# EAGLE design W682X (EAGLE 6.6.0)
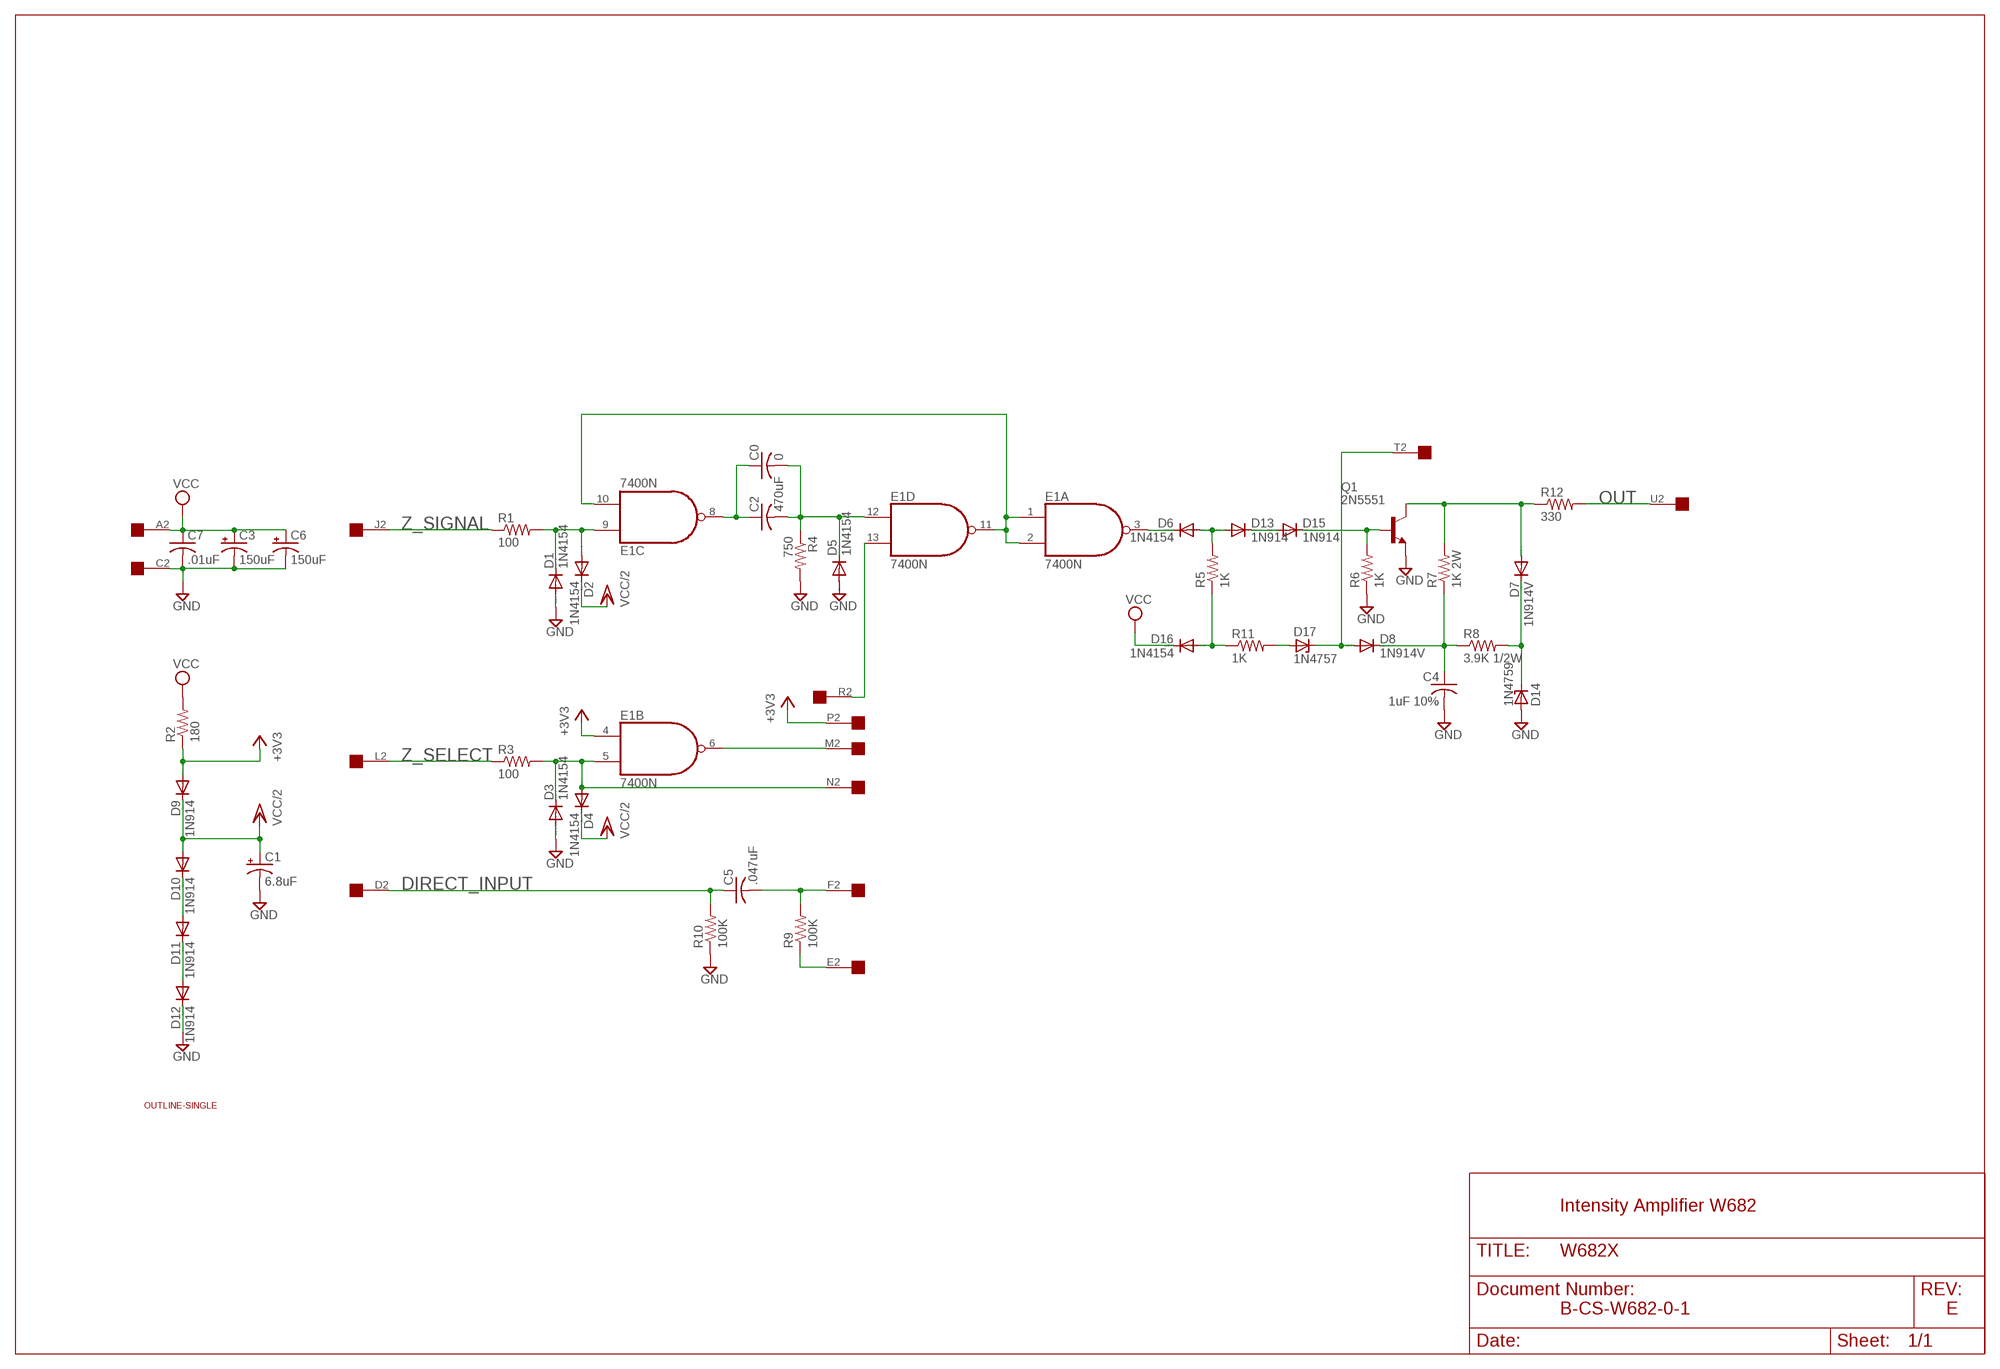
[diagram p0: schematic, sheet 1]

## Parts
C0  0  C-US050-025X075  [C050-025X075]
C1  6.8uF  CPOL-USE20-8AXIAL  [E12-8]
C2  470uF  C-US050-025X075  [C050-025X075]
C3  150uF  CPOL-USE22-9AXIAL  [E22-9]
C4  1uF 10%  C-US325-137X374  [C325-137X374]
C5  .047uF  C-US275-093X316  [C275-093X316]
C6  150uF  CPOL-USE22-9AXIAL  [E22-9]
C7  .01uF  C-US050-025X075  [C050-025X075]
D1  1N4154  DIODE-DO35-10  [DO35-10]
D2  1N4154  DIODE-DO35-10  [DO35-10]
D3  1N4154  DIODE-DO35-10  [DO35-10]
D4  1N4154  DIODE-DO35-10  [DO35-10]
D5  1N4154  DIODE-DO35-10  [DO35-10]
D6  1N4154  DIODE-DO35-10  [DO35-10]
D7  1N914V  DIODE-DO41-10  [DO41-10]
D8  1N914V  DIODE-DO41-10  [DO41-10]
D9  1N914  DIODE-DO35-10  [DO35-10]
D10  1N914  DIODE-DO35-10  [DO35-10]
D11  1N914  DIODE-DO35-10  [DO35-10]
D12  1N914  DIODE-DO35-10  [DO35-10]
D13  1N914  DIODE-DO35-10  [DO35-10]
D14  1N4759  ZENER-DIODEZD-12.5  [ZDIO12.5]
D15  1N914  DIODE-DO35-10  [DO35-10]
D16  1N4154  DIODE-DO35-10  [DO35-10]
D17  1N4757  ZENER-DIODEZD-12.5  [ZDIO12.5]
E1  7400N  [DIL14]
Q1  2N5551  2N2102-NPN-TO39-EBC  [TO39]
R1  100  R-US_0207/10  [0207/10]
R2  180  R-US_0207/10  [0207/10]
R3  100  R-US_0207/10  [0207/10]
R4  750  R-US_0207/10  [0207/10]
R5  1K  R-US_0207/10  [0207/10]
R6  1K  R-US_0207/10  [0207/10]
R7  1K 2W  R-US_0818/25  [0818/25]
R8  3.9K 1/2W  R-US_0411/15  [0411/15]
R9  100K  R-US_0207/10  [0207/10]
R10  100K  R-US_0207/10  [0207/10]
R11  1K  R-US_0207/10  [0207/10]
R12  330  R-US_0207/10  [0207/10]
U$1  OUTLINE-SINGLE  [SINGLE]
U$2  EDGE-1  [EDGE-CON1]

## Nets
+3V3 [supply]: D9.A E1.4(B:I0) R2.1 U$2.P2
DIRECT_INPUT: C5.1 R10.2 U$2.D2
GND [supply]: C1.- C3.- C4.2 C6.- C7.2 D1.A D3.A D5.A D12.C D14.A Q1.1(E) R4.2 R6.1 R10.1 U$2.C2
N$1: E1.13(D:I1) U$2.R2
N$2: D1.C D2.A E1.9(C:I0) R1.2
N$3: E1.1(A:I0) E1.2(A:I1) E1.10(C:I1) E1.11(D:O)
N$4: C0.2 C2.2 D5.C E1.12(D:I0) R4.1
N$5: C0.1 C2.1 E1.8(C:O)
N$6: D3.C D4.A E1.5(B:I1) R3.2 U$2.N2
N$7: D11.C D12.A
N$8: D10.C D11.A
N$9: E1.6(B:O) U$2.M2
N$10: C5.2 R9.2 U$2.F2
N$11: R9.1 U$2.E2
N$13: D16.A R5.1 R11.1
N$14: C4.1 D8.C R7.1 R8.1
N$15: D7.A Q1.3(C) R7.2 R12.1
N$16: D7.C D14.C R8.2
N$17: D6.C E1.3(A:O)
N$18: D6.A D13.A R5.2
N$19: D17.A R11.2
N$20: D8.A D17.C U$2.T2
N$21: D15.C Q1.2(B) R6.2
N$22: D13.C D15.A
OUT: R12.2 U$2.U2
VCC [supply]: C3.+ C6.+ C7.1 D16.C R2.2 U$2.A2
VCC/2 [supply]: C1.+ D2.C D4.C D9.C D10.A
Z_SELECT: R3.1 U$2.L2
Z_SIGNAL: R1.1 U$2.J2
Unconnected: U$2.B2 U$2.H2 U$2.K2 U$2.S2 U$2.V2

## Notes on the sheet
- Intensity Amplifier W682
- B-CS-W682-0-1 | E

## Power pins joined to a net without a drawn wire
GND: E1.7(P:GND)
VCC: E1.14(P:VCC)

## Library data of the parts
C0 C2 C4 C5 C7 = rcl:C-US: CAPACITOR, American symbol
C1 = dec-con:CPOL-USE20-8AXIAL: A 0.8 inch electrolytic.
C3 C6 = rcl:CPOL-US: POLARIZED CAPACITOR, American symbol
D1-D13 D15 D16 = diode:DIODE-: DIODE
D14 D17 = diode:ZENER-DIODE: Z-Diode
E1 = 74xx-us:74*00: Quad 2-input NAND gate
Q1 = transistor:*-NPN-: NPN Transistror BF959 corrected 2008.03.06
R1-R6 R8-R12 = rcl:R-US_: RESISTOR, American symbol
R7 = dec-con:R-US_0818/25: One inch resistor
U$1 = dec-con:OUTLINE-*: Board outlines for DEC boards.
U$2 = dec-con:EDGE-1: Single-Sided DEC Edge Connector -- (side 2)

## Net classes
1 supply: width 0.813 mm

## Board
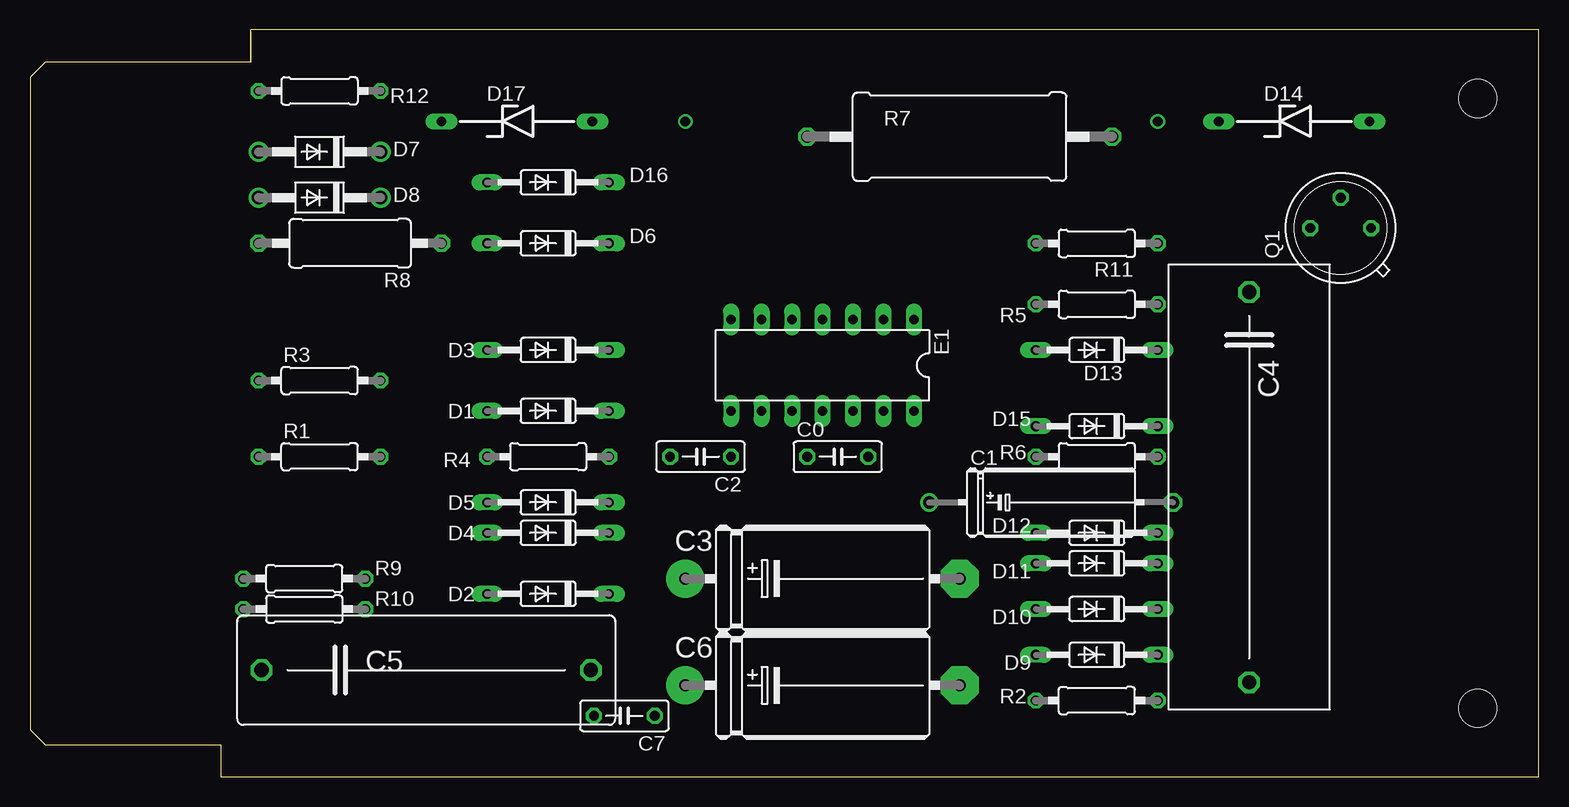
[diagram p1: board, top side]
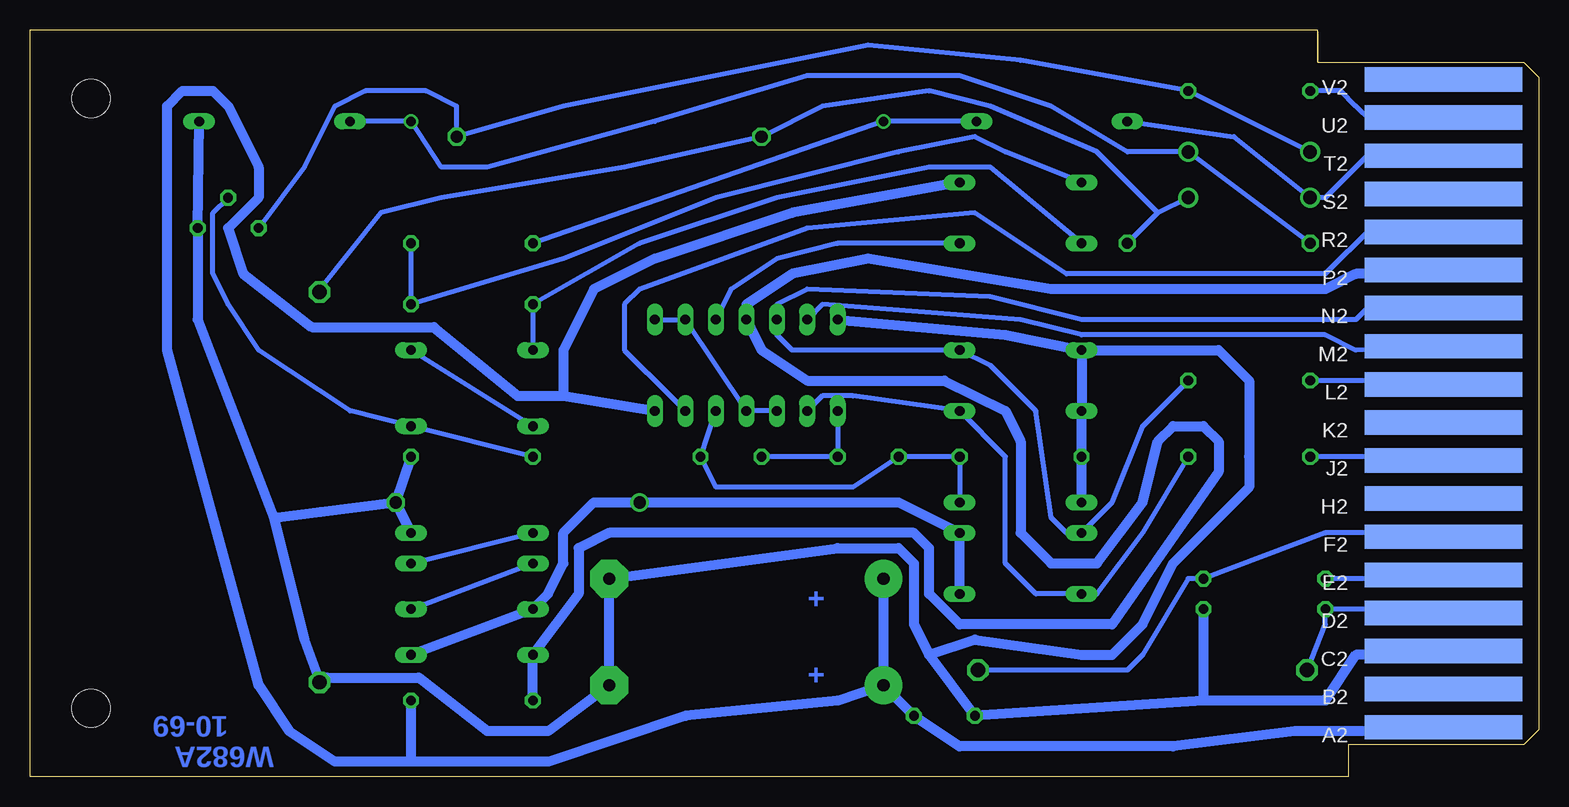
[diagram p2: board, bottom side, seen from below]

Size 125.73 x 62.23 mm. Coordinates in mm from the lower left corner, seen from the top.
Copper layers (1+16): Top 0.035mm / dielectric 1.5mm / Bottom 0.035mm
Design rules "16mils": minimum track width 16mil, minimum drill 32mil, track to track 15mil, track to pad 10mil, pad to pad 10mil, via to via 10mil, smd to smd 10mil, copper to edge 13mil, drill to drill 10mil, minimum pad ring 10mil, minimum via ring 8mil, stop-mask expansion 0mil, vias tented up to drill 0mil, thermal gap 10mil

### Footprints (pad centres in the part's own frame; a part is rotated, then mirrored left to right if it is on the bottom)
C050-025X075 = drill 0.813 octagon: 1 -2.54,0; 2 2.54,0
E12-8 = drill 1.016: + -10.16,0 | drill 1.016 octagon: - 10.16,0
E22-9 = drill 1.016 pad 3.15: + -11.43,0 | drill 1.016 pad 3.15 octagon: - 11.43,0
C325-137X374 = drill 1.194 octagon: 1 -16.256,0; 2 16.256,0
C275-093X316 = drill 1.194 octagon: 1 -13.716,0; 2 13.716,0
DO35-10 = drill 0.813 long: A 5.08,0; C -5.08,0
DO41-10 = drill 1.118: A 5.08,0; C -5.08,0
ZDIO12.5 = drill 0.813 long: A 6.223,0; C -6.35,0
DIL14 = drill 0.813 long: 1 -7.62,-3.81; 2 -5.08,-3.81; 3 -2.54,-3.81; 4 0,-3.81; 5 2.54,-3.81; 6 5.08,-3.81; 7 7.62,-3.81; 8 7.62,3.81; 9 5.08,3.81; 10 2.54,3.81; 11 0,3.81; 12 -2.54,3.81; 13 -5.08,3.81; 14 -7.62,3.81
TO39 = drill 0.813 octagon: 1 0,-2.54; 2 2.54,0; 3 0,2.54
0207/10 = drill 0.813 octagon: 1 -5.08,0; 2 5.08,0
0818/25 = drill 1.016 octagon: 1 -12.7,0; 2 12.7,0
0411/15 = drill 0.914 octagon: 1 -7.62,0; 2 7.62,0
SINGLE = hole 3.175: 120.65,56.515; 120.65,5.715
EDGE-CON1 = smd 13.106 x 2.032 bottom: A2 7.938,4.128; B2 7.938,7.303; C2 7.938,10.477; D2 7.938,13.652; E2 7.938,16.828; F2 7.938,20.003; H2 7.938,23.177; J2 7.938,26.352; K2 7.938,29.527; L2 7.938,32.703; M2 7.938,35.877; N2 7.938,39.053; P2 7.938,42.227; R2 7.938,45.403; S2 7.938,48.578; T2 7.938,51.752; U2 7.938,54.928; V2 7.938,58.102

### Placement (x,y rotation side)
C0  67.31,26.67 0 top
C1  85.09,22.86 0 top
C2  55.88,26.67 180 top
C3  66.04,16.51 0 top
C4  101.6,24.13 270 top
C5  33.02,8.89 0 top
C6  66.04,7.62 0 top
C7  49.53,5.08 180 top
D1  43.18,30.48 180 top
D2  43.18,15.24 180 top
D3  43.18,35.56 180 top
D4  43.18,20.32 180 top
D5  43.18,22.86 180 top
D6  43.18,44.45 180 top
D7  24.13,52.07 180 top
D8  24.13,48.26 180 top
D9  88.9,10.16 180 top
D10  88.9,13.97 180 top
D11  88.9,17.78 180 top
D12  88.9,20.32 180 top
D13  88.9,35.56 180 top
D14  105.41,54.61 0 top
D15  88.9,29.21 180 top
D16  43.18,49.53 180 top
D17  40.64,54.61 0 top
E1  66.04,34.29 180 top
Q1  109.22,45.72 90 top
R1  24.13,26.67 0 top
R2  88.9,6.35 0 top
R3  24.13,33.02 0 top
R4  43.18,26.67 180 top
R5  88.9,39.37 180 top
R6  88.9,26.67 180 top
R7  77.47,53.34 0 top
R8  26.67,44.45 180 top
R9  22.86,16.51 0 top
R10  22.86,13.97 180 top
R11  88.9,44.45 180 top
R12  24.13,57.15 180 top
U$1  0,0 0 top
U$2  0,0 0 top

### Tracks (layer width: path | path; a pad name or v marks a point on that pad's centre or on a via)
+3V3
  Bottom 0.813: U$2.P2 8.89,41.91 15.24,41.91 17.78,40.64 40.64,40.64 55.88,43.18 62.23,41.91 66.04,39.37 E1.4 64.77,35.56 60.96,33.02 49.53,33.02 44.45,30.48 43.18,27.94 43.18,20.32 40.64,17.78 36.83,17.78 33.02,22.86 31.75,27.94 30.48,29.21 27.94,29.21 26.67,27.94 26.67,25.4 35.56,12.7 48.26,12.7 50.8,15.24 50.8,19.05 52.07,20.32 77.47,20.32 80.01,19.05 80.01,15.24 D9.A R2.1
DIRECT_INPUT
  Bottom 0.406: U$2.D2 8.89,13.97 R10.2 17.78,12.7 C5.1
GND
  Bottom 0.813: E1.7 44.45,36.83 D3.A | D3.A D1.A R4.2 D5.A | D3.A 26.67,35.56 24.13,33.02 24.13,26.67 24.13,24.13 30.48,17.78 33.02,12.7 35.56,10.16 38.1,10.16 46.99,11.43 50.8,10.16 | U$2.C2 8.89,10.16 15.24,10.16 17.78,6.35 27.94,6.35 | 27.94,6.35 C7.2 50.8,10.16 | 50.8,10.16 52.07,12.7 52.07,17.78 53.34,19.05 58.42,19.05 C3.- C6.- 82.55,3.81 87.63,3.81 93.35,8.26 100.97,8.26 C4.2 102.87,11.43 105.41,21.59 | R10.1 27.94,6.35 | D12.C C1.- | R6.1 C1.- | 105.41,21.59 111.76,38.1 Q1.1 D14.A | 105.41,21.59 101.5,22.08 C1.-
N$1
  Bottom 0.406: U$2.R2 8.57,45.4 8.89,45.72 13.97,45.72 17.78,41.91 39.37,41.91 46.99,46.99 60.96,45.72 74.93,40.64 76.2,39.37 76.2,35.56 72.39,31.75 E1.13
N$2
  Bottom 0.406: R1.2 33.02,20.32 36.83,15.24 D2.A 41.91,15.24 44.45,17.78 44.45,26.67 D1.C 57.15,31.75 59.69,31.75 E1.9
N$3
  Bottom 0.406: E1.10 E1.11 E1.2 E1.1
N$4
  Bottom 0.406: D5.C R4.1 C2.2 57.15,24.13 68.58,24.13 C0.2 E1.12
N$5
  Bottom 0.406: C0.1 C2.1 E1.8
N$6
  Bottom 0.406: U$2.N2 10.16,39.37 13.97,39.37 15.24,38.1 38.1,38.1 45.72,40.01 60.96,40.64 63.5,39.37 E1.5 63.5,36.83 62.23,35.56 D3.C 45.72,34.29 41.91,30.48 40.64,21.59 39.37,20.32 D4.A 35.56,22.86 33.02,29.21 R3.2
N$7
  Bottom 0.406: D11.C D12.A
N$8
  Bottom 0.406: D10.C D11.A
N$9
  Bottom 0.406: U$2.M2 15.24,35.56 17.78,36.83 38.1,36.83 43.18,38.1 59.69,39.37 E1.6
N$10
  Bottom 0.406: U$2.F2 8.89,20.32 17.78,20.32 R9.2 29.21,16.51 33.02,10.16 34.29,8.89 45.72,8.89 C5.2
N$11
  Bottom 0.406: U$2.E2 8.89,16.51 R9.1
N$13
  Bottom 0.406: R11.1 R5.1 81.28,43.18 68.58,48.26 53.34,52.07 46.99,53.34 44.45,52.07 D16.A
N$14
  Bottom 0.406: D8.C 31.75,46.99 | 31.75,46.99 R8.1 | 31.75,46.99 36.83,52.07 45.72,55.88 50.8,57.15 59.69,55.88 R7.1 76.2,50.8 91.44,48.26 96.52,46.99 101.6,40.64 C4.1
N$15
  Bottom 0.406: D7.A R12.1 43.18,59.69 55.88,60.96 81.28,55.88 R7.2 90.17,54.61 90.17,55.88 92.71,57.15 97.79,57.15 100.33,55.88 102.87,50.8 Q1.3
N$16  (via drill 0.81)
  Bottom 0.406: R8.2 D7.C 34.29,52.07 40.64,55.88 48.26,58.42 60.96,58.42 73.66,54.61 87.63,50.8 91.44,50.8 v93.98,54.61 D14.C
N$17
  Bottom 0.406: D6.C 58.42,44.45 63.5,43.18 67.31,40.64 E1.3
N$18
  Bottom 0.406: D13.A R5.2 74.93,44.45 63.5,48.26 50.8,50.8 45.72,50.8 D6.A
N$19  (via drill 0.81)
  Bottom 0.406: D17.A v54.61,54.61 R11.2
N$20
  Bottom 0.406: U$2.T2 8.57,51.75 8.89,52.07 13.97,52.07 17.78,48.26 D8.A 25.4,53.34 D17.C
N$21
  Bottom 0.406: R6.2 D15.C 99.06,30.48 106.68,35.56 109.22,39.37 110.49,41.91 110.49,46.99 Q1.2
N$22
  Bottom 0.406: D15.A D13.C
OUT
  Bottom 0.406: U$2.U2 8.57,54.93 8.89,54.61 13.97,54.61 15.24,55.88 16.51,57.15 R12.2
VCC
  Bottom 0.813: U$2.A2 8.89,3.81 20.32,3.81 30.48,2.54 48.26,2.54 C7.1 C6.+ | C3.+ C6.+ | D16.C 62.23,46.99 73.66,43.18 78.74,40.64 81.28,35.56 81.28,31.75 | 81.28,31.75 E1.14 | C6.+ 58.42,6.35 71.12,5.08 82.55,1.27 93.98,1.27 | 93.98,1.27 R2.2 | 93.98,1.27 100.33,1.27 104.14,3.81 106.68,7.62 114.3,35.56 114.3,54.61 114.3,55.88 113.03,57.15 110.49,57.15 109.22,55.88 106.68,50.8 106.68,48.26 109.22,45.72 107.95,41.91 102.24,37.47 92.08,37.47 85.09,31.75 81.28,31.75
VCC/2
  Bottom 0.813: D2.C D4.C 53.34,22.86 C1.+ 78.74,22.86 81.28,20.32 81.28,17.78 82.55,15.24 D10.A D9.C
Z_SELECT
  Bottom 0.406: U$2.L2 8.57,32.7 8.89,33.02 R3.1
Z_SIGNAL
  Bottom 0.406: U$2.J2 8.57,26.35 8.89,26.67 R1.1

### Text on the board
Bottom: + | + | 10-69 | W682A